# EAGLE schematic hm-cc-vd (EAGLE 6.4)
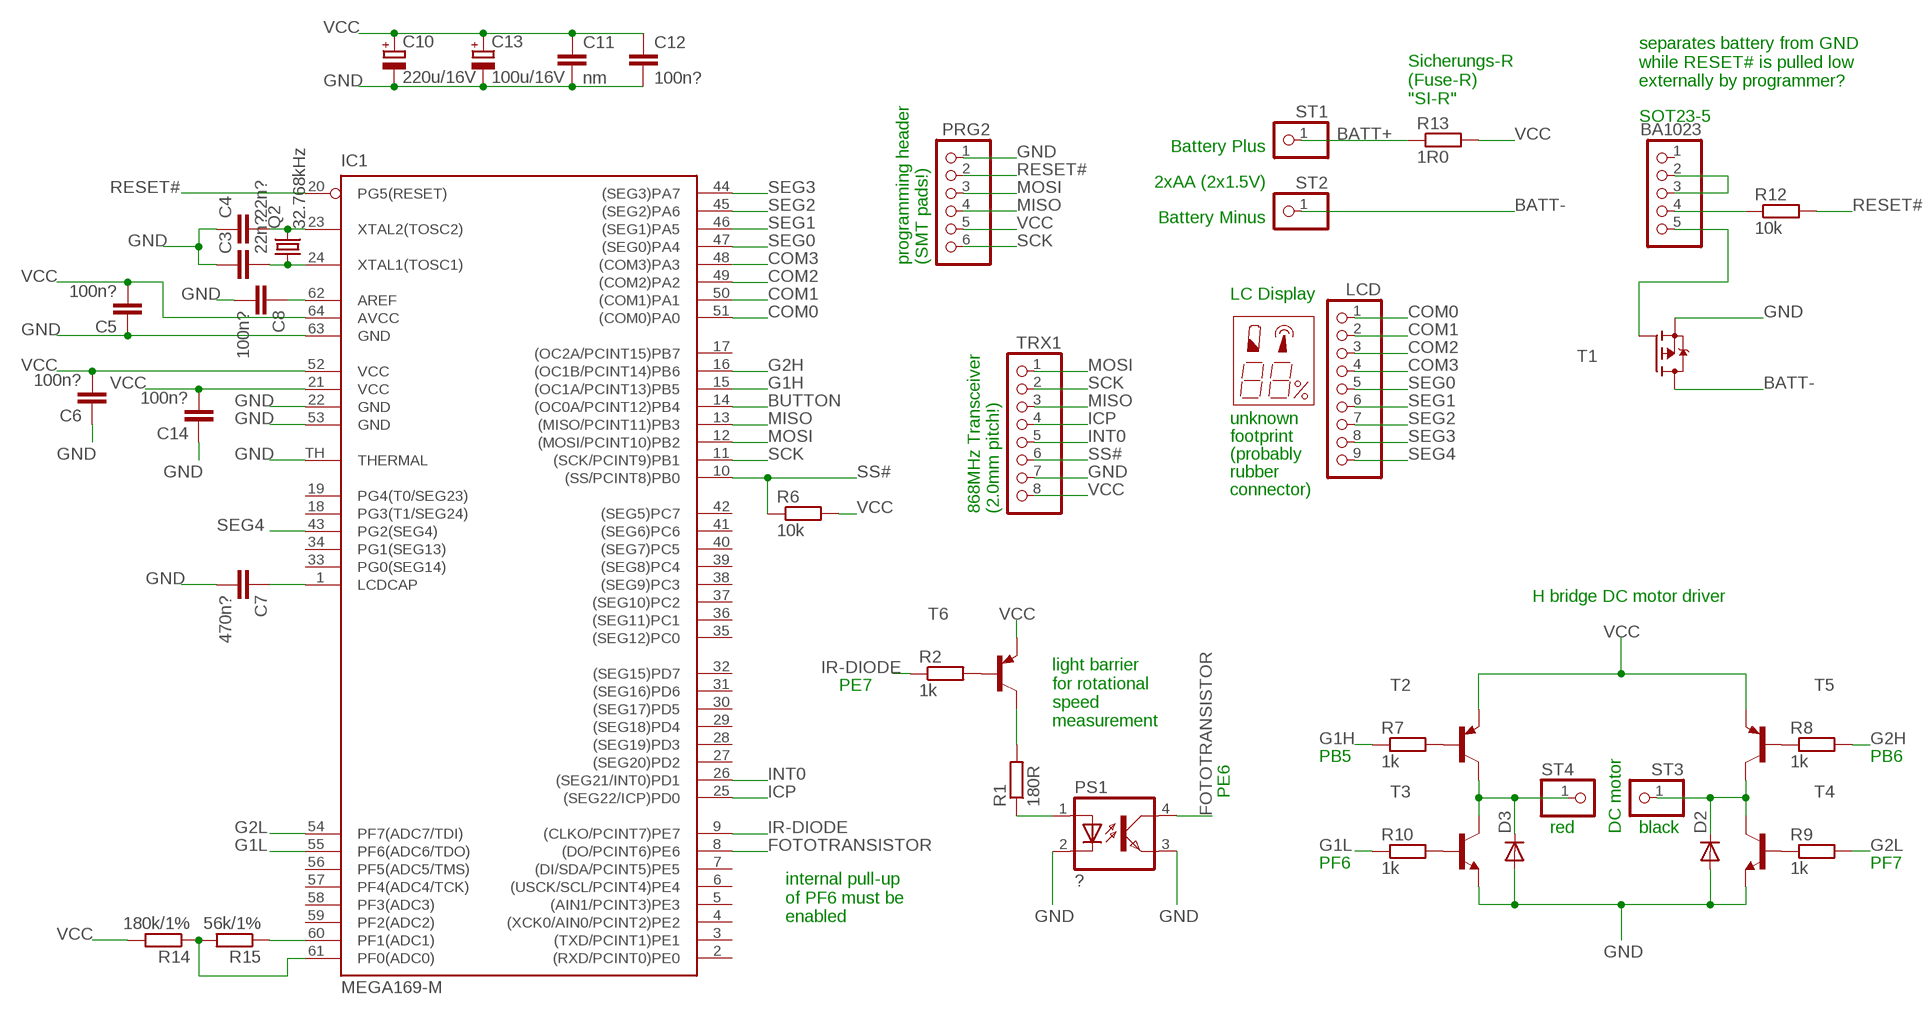
[diagram p0: schematic, sheet 1]

## Parts
BA1023  PINHD-1X5  [1X05]
C3  22n?  C-EUC0603K  [C0603K]
C4  22n?  C-EUC0603K  [C0603K]
C5  100n?  C-EUC0805  [C0805]
C6  100n?  C-EUC0805  [C0805]
C7  470n?  C-EUC0805  [C0805]
C8  100n?  C-EUC0805  [C0805]
C10  220u/16V  CPOL-EUE3.5-10  [E3,5-10]
C11  nm  C-EUC0805  [C0805]
C12  100n?  C-EUC0805  [C0805]
C13  100u/16V  CPOL-EUE2,5-6E  [E2,5-6E]
C14  100n?  C-EUC0805  [C0805]
D2  DIODE-MELF-MLL41  [MELF-MLL41]
D3  DIODE-MELF-MLL41  [MELF-MLL41]
IC1  MEGA169-M  [MLF64-TH]
LCD  PINHD-1X9  [1X09]
PRG2  PINHD-1X6  [1X06]
PS1  ?  LTV816  [DIL04]
Q2  32.768kHz  CRYSTALTC26H  [TC26H]
R1  180R  R-EU_R0805  [R0805]
R2  1k  R-EU_R0805  [R0805]
R6  10k  R-EU_R0805  [R0805]
R7  1k  R-EU_R0805  [R0805]
R8  1k  R-EU_R0805  [R0805]
R9  1k  R-EU_R0805  [R0805]
R10  1k  R-EU_R0805  [R0805]
R12  10k  R-EU_R0805  [R0805]
R13  1R0  R-EU_R0805  [R0805]
R14  180k/1%  R-EU_R0805  [R0805]
R15  56k/1%  R-EU_R0805  [R0805]
ST1  PINHD-1X1  [1X01]
ST2  PINHD-1X1  [1X01]
ST3  PINHD-1X1  [1X01]
ST4  PINHD-1X1  [1X01]
T1  BSA223SP  [SC75_INFINEON]
T2  -PNP-SOT23-BCE  [SOT23-BCE]
T3  -NPN-SOT23-EBC  [SOT23-EBC]
T4  -NPN-SOT23-EBC  [SOT23-EBC]
T5  -PNP-SOT23-BCE  [SOT23-BCE]
T6  -PNP-SOT23-BCE  [SOT23-BCE]
TRX1  PINHD-1X8  [1X08]

## Nets
BATT+: R13.1 ST1.1
BATT-: ST2.1 T1.2(D)
BUTTON: IC1.14((OC0A/PCINT12)PB4)
COM0: IC1.51((COM0)PA0) LCD.1
COM1: IC1.50((COM1)PA1) LCD.2
COM2: IC1.49((COM2)PA2) LCD.3
COM3: IC1.48((COM3)PA3) LCD.4
FOTOTRANSISTOR: IC1.8((DO/PCINT6)PE6) PS1.4(COL)
G1H: IC1.15((OC1A/PCINT13)PB5) R7.1
G1L: IC1.55(PF6(ADC6/TDO)) R10.1
G2H: IC1.16((OC1B/PCINT14)PB6) R8.2
G2L: IC1.54(PF7(ADC7/TDI)) R9.2
GND: C3.1 C4.1 C5.1 C6.1 C7.2 C8.2 C10.- C11.2 C12.2 C13.- C14.1 D2.A D3.A IC1.22(GND) IC1.53(GND) IC1.63(GND) IC1.TH(THERMAL) PRG2.1 PS1.2(C) PS1.3(EMIT) T1.3(S) T3.E T4.E TRX1.7
ICP: IC1.25((SEG22/ICP)PD0) TRX1.4
INT0: IC1.26((SEG21/INT0)PD1) TRX1.5
IR-DIODE: IC1.9((CLKO/PCINT7)PE7) R2.1
MISO: IC1.13((MISO/PCINT11)PB3) PRG2.4 TRX1.3
MOSI: IC1.12((MOSI/PCINT10)PB2) PRG2.3 TRX1.1
N$1: BA1023.2 BA1023.3
N$2: BA1023.4 R12.1
N$3: IC1.60(PF1(ADC1)) R15.1
N$4: C8.1 IC1.62(AREF)
N$5: C7.1 IC1.1(LCDCAP)
N$6: C4.2 IC1.23(XTAL2(TOSC2)) Q2.2
N$7: C3.2 IC1.24(XTAL1(TOSC1)) Q2.1
N$8: R2.2 T6.B
N$9: IC1.61(PF0(ADC0)) R14.1 R15.2
N$10: BA1023.5 T1.1(G)
N$11: R1.2 T6.C
N$12: PS1.1(A) R1.1
N$13: R7.2 T2.B
N$14: R10.2 T3.B
N$17: D3.C ST4.1 T2.C T3.C
N$20: R8.1 T5.B
N$21: R9.1 T4.B
N$22: D2.C ST3.1 T4.C T5.C
RESET#: IC1.20(PG5(RESET)) PRG2.2 R12.2
SCK: IC1.11((SCK/PCINT9)PB1) PRG2.6 TRX1.2
SEG0: IC1.47((SEG0)PA4) LCD.5
SEG1: IC1.46((SEG1)PA5) LCD.6
SEG2: IC1.45((SEG2)PA6) LCD.7
SEG3: IC1.44((SEG3)PA7) LCD.8
SEG4: IC1.43(PG2(SEG4)) LCD.9
SS#: IC1.10((SS/PCINT8)PB0) R6.1 TRX1.6
VCC: C5.2 C6.2 C10.+ C11.1 C12.1 C13.+ C14.2 IC1.21(VCC) IC1.52(VCC) IC1.64(AVCC) PRG2.5 R6.2 R13.2 R14.2 T2.E T5.E T6.E TRX1.8
Unconnected: BA1023.1 IC1.2((RXD/PCINT0)PE0) IC1.3((TXD/PCINT1)PE1) IC1.4((XCK0/AIN0/PCINT2)PE2) IC1.5((AIN1/PCINT3)PE3) IC1.6((USCK/SCL/PCINT4)PE4) IC1.7((DI/SDA/PCINT5)PE5) IC1.17((OC2A/PCINT15)PB7) IC1.18(PG3(T1/SEG24)) IC1.19(PG4(T0/SEG23)) IC1.27((SEG20)PD2) IC1.28((SEG19)PD3) IC1.29((SEG18)PD4) IC1.30((SEG17)PD5) IC1.31((SEG16)PD6) IC1.32((SEG15)PD7) IC1.33(PG0(SEG14)) IC1.34(PG1(SEG13)) IC1.35((SEG12)PC0) IC1.36((SEG11)PC1) IC1.37((SEG10)PC2) IC1.38((SEG9)PC3) IC1.39((SEG8)PC4) IC1.40((SEG7)PC5) IC1.41((SEG6)PC6) IC1.42((SEG5)PC7) IC1.56(PF5(ADC5/TMS)) IC1.57(PF4(ADC4/TCK)) IC1.58(PF3(ADC3)) IC1.59(PF2(ADC2))

## Notes on the sheet
- separates battery from GND
  while RESET# is pulled low
  externally by programmer?
- Sicherungs-R
  (Fuse-R)
  "SI-R"
- SOT23-5
- Battery Plus
- 2xAA (2x1.5V)
- Battery Minus
- programming header
  (SMT pads!)
- LC Display
- unknown
- footprint
- (probably
- rubber
- connector)
- 868MHz Transceiver
  (2.0mm pitch!)
- H bridge DC motor driver
- PE7
- light barrier
  for rotational
  speed
  measurement
- PB5 | PB6
- PE6
- red | DC motor | black
- PF6 | PF7
- internal pull-up
  of PF6 must be
  enabled

## Library data of the parts
BA1023 = pinhead:PINHD-1X5: PIN HEADER
C3-C8 C11 C12 C14 = rcl:C-EU: CAPACITOR, European symbol
C10 C13 = rcl:CPOL-EU: POLARIZED CAPACITOR, European symbol
D2 D3 = diode:DIODE-: DIODE
IC1 = atmel:MEGA169-M: MICROCONTROLLER 16 Kbytes FLASH 1 Kbytes SRAM 512 bytes EEPROM USART 8-channel 10 bit ADC 4x25 Segment LCD Driver Source: avr.lbr; OC_FARNELL: unknown; OC_NEWARK: unknown
LCD = pinhead:PINHD-1X9: PIN HEADER
PRG2 = pinhead:PINHD-1X6: PIN HEADER
PS1 = optocoupler:LTV816: OPTO COUPLER Source: LITEON, LTV816.pdf; OC_FARNELL: unknown; OC_NEWARK: unknown
Q2 = crystal:CRYSTAL: CRYSTAL; OC_FARNELL: unknown; OC_NEWARK: unknown
R1 R2 R6-R10 R12-R15 = rcl:R-EU_: RESISTOR, European symbol
ST1-ST4 = pinhead:PINHD-1X1: PIN HEADER
T1 = transistor-fet:BSA223SP: OptiMOS(R)-P Small-Signal-Transistor P-Channel, Enhancement mode, Super Logic Level (2.5 V rated) Source: http://www.infineon.com/upload/Document/BSA223SP_Rev1.3.pdf
T2 T5 T6 = transistor:*-PNP-: PNP Transistror
T3 T4 = transistor:*-NPN-: NPN Transistror BF959 corrected 2008.03.06
TRX1 = pinhead:PINHD-1X8: PIN HEADER